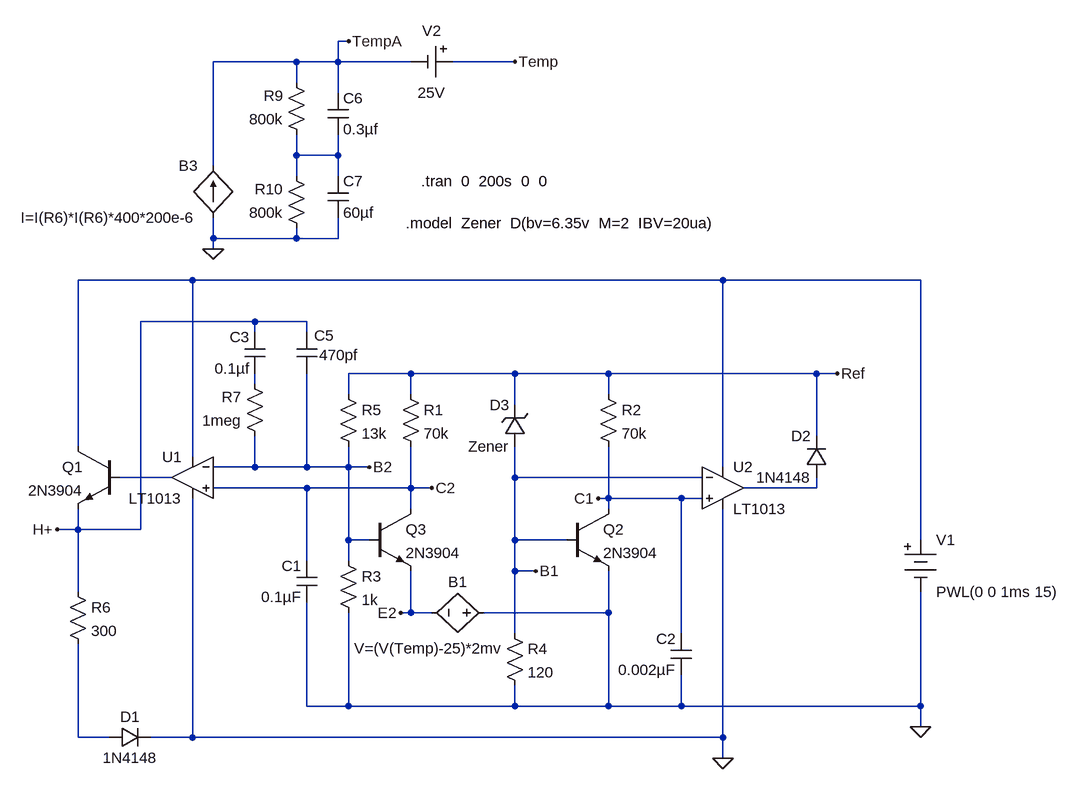
[diagram p0: schematic LTZ1000A Model.asc]
LTZ1000A Model.asc, the LTspice schematic file:
Version 4
SHEET 1 1228 824
WIRE 48 -464 32 -464
WIRE -32 -432 -160 -432
WIRE 32 -432 32 -464
WIRE 32 -432 -32 -432
WIRE 144 -432 32 -432
WIRE 304 -432 208 -432
WIRE -32 -400 -32 -432
WIRE 32 -384 32 -432
WIRE -32 -288 -32 -320
WIRE 32 -288 32 -320
WIRE 32 -288 -32 -288
WIRE -160 -272 -160 -432
WIRE -32 -256 -32 -288
WIRE 32 -256 32 -288
WIRE -160 -160 -160 -192
WIRE -32 -160 -32 -176
WIRE -32 -160 -160 -160
WIRE 32 -160 32 -192
WIRE 32 -160 -32 -160
WIRE -160 -144 -160 -160
WIRE -192 -96 -368 -96
WIRE 624 -96 -192 -96
WIRE 928 -96 624 -96
WIRE -96 -32 -272 -32
WIRE -16 -32 -96 -32
WIRE -96 -16 -96 -32
WIRE -16 -16 -16 -32
WIRE 144 48 48 48
WIRE 304 48 144 48
WIRE 448 48 304 48
WIRE 768 48 448 48
WIRE 800 48 768 48
WIRE -96 64 -96 48
WIRE 48 80 48 48
WIRE 144 80 144 48
WIRE 448 80 448 48
WIRE 304 96 304 48
WIRE 768 144 768 48
WIRE -368 160 -368 -96
WIRE -192 176 -192 -96
WIRE -96 192 -96 144
WIRE -96 192 -160 192
WIRE -16 192 -16 48
WIRE -16 192 -96 192
WIRE 48 192 48 160
WIRE 48 192 -16 192
WIRE 80 192 48 192
WIRE 624 192 624 -96
WIRE -224 208 -304 208
WIRE 304 208 304 160
WIRE 592 208 304 208
WIRE -16 224 -160 224
WIRE 144 224 144 160
WIRE 144 224 -16 224
WIRE 176 224 144 224
WIRE 768 224 768 208
WIRE 768 224 656 224
WIRE 448 240 448 160
WIRE 448 240 432 240
WIRE 560 240 448 240
WIRE 592 240 560 240
WIRE 144 256 144 224
WIRE 448 256 448 240
WIRE -368 288 -368 256
WIRE -368 288 -400 288
WIRE -272 288 -272 -32
WIRE -272 288 -368 288
WIRE 48 304 48 192
WIRE 80 304 48 304
WIRE 304 304 304 208
WIRE 384 304 304 304
WIRE 928 304 928 -96
WIRE -16 336 -16 224
WIRE 48 336 48 304
WIRE 304 352 304 304
WIRE 336 352 304 352
WIRE -368 384 -368 288
WIRE 144 416 144 352
WIRE 144 416 128 416
WIRE 176 416 144 416
WIRE 448 416 448 352
WIRE 448 416 256 416
WIRE 304 448 304 352
WIRE 560 448 560 240
WIRE -16 560 -16 400
WIRE 48 560 48 416
WIRE 48 560 -16 560
WIRE 304 560 304 528
WIRE 304 560 48 560
WIRE 448 560 448 416
WIRE 448 560 304 560
WIRE 560 560 560 512
WIRE 560 560 448 560
WIRE 928 560 928 384
WIRE 928 560 560 560
WIRE 928 592 928 560
WIRE -368 608 -368 464
WIRE -320 608 -368 608
WIRE -192 608 -192 240
WIRE -192 608 -256 608
WIRE 624 608 624 256
WIRE 624 608 -192 608
WIRE 624 640 624 608
FLAG 624 640 0
FLAG 928 592 0
FLAG 800 48 Ref
FLAG -400 288 H+
FLAG 336 352 B1
FLAG 432 240 C1
FLAG 80 192 B2
FLAG 176 224 C2
FLAG 128 416 E2
FLAG -160 -144 0
FLAG 304 -432 Temp
FLAG 48 -464 TempA
SYMBOL LT1013 -192 144 M0
SYMATTR InstName U1
SYMBOL LT1013 624 160 R0
SYMATTR InstName U2
SYMBOL res 128 64 R0
SYMATTR InstName R1
SYMATTR Value 70k
SYMBOL res 432 64 R0
SYMATTR InstName R2
SYMATTR Value 70k
SYMBOL res 32 320 R0
SYMATTR InstName R3
SYMATTR Value 1k
SYMBOL res 288 432 R0
SYMATTR InstName R4
SYMATTR Value 120
SYMBOL res 32 64 R0
SYMATTR InstName R5
SYMATTR Value 13k
SYMBOL res -384 368 R0
SYMATTR InstName R6
SYMATTR Value 300
SYMBOL cap 0 336 M0
SYMATTR InstName C1
SYMATTR Value 0.1µF
SYMBOL cap 576 448 M0
SYMATTR InstName C2
SYMATTR Value 0.002µF
SYMBOL cap -80 48 R180
WINDOW 0 24 56 Left 2
WINDOW 3 24 8 Left 2
SYMATTR InstName C3
SYMATTR Value 0.1µf
SYMBOL diode -320 624 R270
WINDOW 0 32 32 VTop 2
WINDOW 3 0 32 VBottom 2
SYMATTR InstName D1
SYMATTR Value 1N4148
SYMBOL npn -304 160 M0
SYMATTR InstName Q1
SYMATTR Value 2N3904
SYMBOL diode 784 208 R180
WINDOW 0 24 64 Left 2
WINDOW 3 24 0 Left 2
SYMATTR InstName D2
SYMATTR Value 1N4148
SYMBOL npn 384 256 R0
SYMATTR InstName Q2
SYMATTR Value 2N3904
SYMBOL zener 320 160 R180
WINDOW 0 24 64 Left 2
WINDOW 3 24 0 Left 2
SYMATTR InstName D3
SYMATTR Value Zener
SYMBOL npn 80 256 R0
SYMATTR InstName Q3
SYMATTR Value 2N3904
SYMBOL res -80 160 R180
WINDOW 0 36 76 Left 2
WINDOW 3 36 40 Left 2
SYMATTR InstName R7
SYMATTR Value 1meg
SYMBOL battery 928 288 R0
SYMATTR InstName V1
SYMATTR Value PWL(0 0 1ms 15)
SYMBOL bv 272 416 R90
WINDOW 0 -32 56 VBottom 2
WINDOW 3 39 100 VTop 2
SYMATTR InstName B1
SYMATTR Value V=(V(Temp)-25)*2mv
SYMBOL cap 0 48 R180
WINDOW 0 -26 59 Left 2
WINDOW 3 -64 29 Left 2
SYMATTR InstName C5
SYMATTR Value 470pf
SYMBOL res -16 -304 R180
WINDOW 0 36 76 Left 2
WINDOW 3 36 40 Left 2
SYMATTR InstName R9
SYMATTR Value 800k
SYMBOL cap 16 -384 R0
SYMATTR InstName C6
SYMATTR Value 0.3µf
SYMBOL res -16 -160 R180
WINDOW 0 36 76 Left 2
WINDOW 3 36 40 Left 2
SYMATTR InstName R10
SYMATTR Value 800k
SYMBOL cap 16 -256 R0
SYMATTR InstName C7
SYMATTR Value 60µf
SYMBOL bi -160 -192 R180
WINDOW 0 24 80 Left 2
WINDOW 3 24 0 Left 2
SYMATTR InstName B3
SYMATTR Value I=I(R6)*I(R6)*400*200e-6
SYMBOL cell 208 -432 R90
WINDOW 0 -32 32 VBottom 2
WINDOW 3 32 32 VTop 2
SYMATTR InstName V2
SYMATTR Value 25V
TEXT 136 -184 Left 2 !.model  Zener  D(bv=6.35v  M=2  IBV=20ua)
TEXT 160 -248 Left 2 !.tran  0  200s  0  0

The netlist it stands for:
* LTZ1000A Model.asc
XU1 C2 B2 N002 0 N004 LT1013  ; pins In+ In- V+ V- OUT
XU2 C1 B1 N002 0 N005 LT1013  ; pins In+ In- V+ V- OUT
R1 Ref C2 70k
R2 Ref C1 70k
R3 B2 0 1k
R4 B1 0 120
R5 Ref B2 13k
R6 H+ N006 300
C1 C2 0 0.1µF
C2 C1 0 0.002µF
C3 N003 H+ 0.1µf
D1 N006 0 1N4148
Q1 N002 N004 H+ 0 2N3904
D2 N005 Ref 1N4148
Q2 C1 B1 0 0 2N3904
D3 B1 Ref Zener
Q3 C2 B2 E2 0 2N3904
R7 B2 N003 1meg
V1 N002 0 PWL(0 0 1ms 15)
B1 0 E2 V=(V(Temp)-25)*2mv
C5 B2 H+ 470pf
R9 N001 TempA 800k
C6 TempA N001 0.3µf
R10 0 N001 800k
C7 N001 0 60µf
B3 0 TempA I=I(R6)*I(R6)*400*200e-6
V2 Temp TempA 25V
.model D D
.lib standard.dio
.model NPN NPN
.model PNP PNP
.lib standard.bjt
.model  Zener  D(bv=6.35v  M=2  IBV=20ua)
.tran  0  200s  0  0
.lib LTC.lib
.backanno
.end